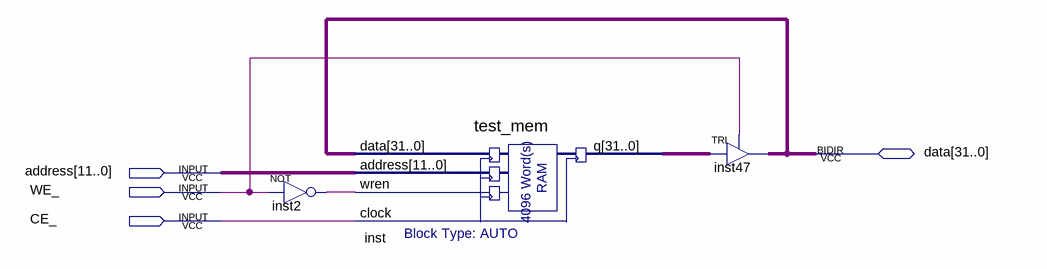
[diagram p0: schematic sheet]
// Quartus schematic test_mem_block.bdf as structural Verilog: 3 symbols, 4 pins
module test_mem_block (
  input  [11:0] address,
  input  WE_,
  input  CE_,
  inout  [31:0] data
);

  wire inst2_out;
  wire [31:0] inst_q;

  not inst2 (inst2_out, WE_);
  test_mem inst (.data(data), .address(address), .wren(inst2_out), .clock(CE_), .q(inst_q));
  TRI inst47[31:0] (.IN(inst_q), .OE(WE_), .OUT(data));
endmodule
